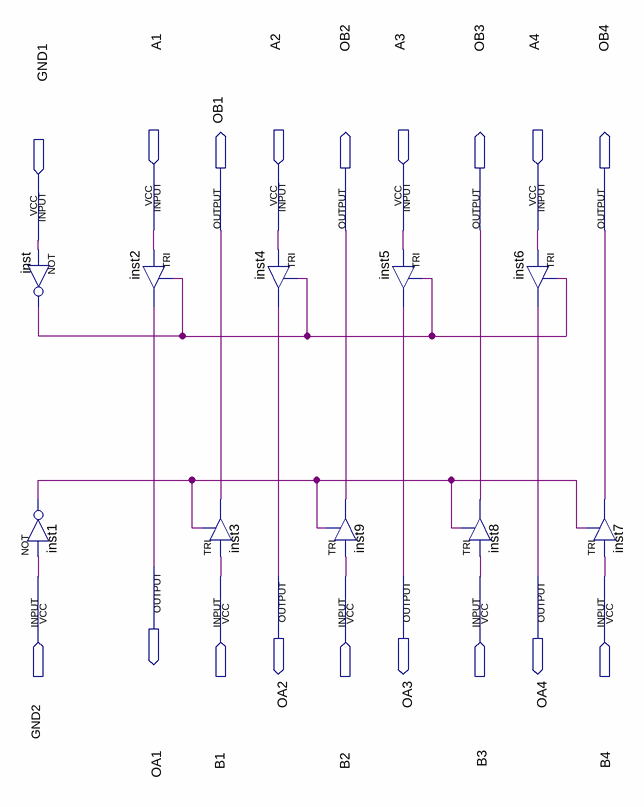
[diagram p0: schematic sheet]
// Quartus schematic ALP74LS244.bdf as structural Verilog: 10 symbols, 18 pins
module ALP74LS244 (
  input  A1,
  input  A2,
  input  A3,
  input  A4,
  input  GND1,
  input  GND2,
  input  B1,
  input  B2,
  input  B3,
  input  B4,
  output OB1,
  output OB2,
  output OB3,
  output OB4,
  output OA1,
  output OA2,
  output OA3,
  output OA4
);

  wire inst1_out, inst_out;

  not inst (inst_out, GND1);
  not inst1 (inst1_out, GND2);
  TRI inst2 (.IN(A1), .OE(inst_out), .OUT(OA1));
  TRI inst4 (.IN(A2), .OE(inst_out), .OUT(OA2));
  TRI inst3 (.IN(B1), .OE(inst1_out), .OUT(OB1));
  TRI inst9 (.IN(B2), .OE(inst1_out), .OUT(OB2));
  TRI inst5 (.IN(A3), .OE(inst_out), .OUT(OA3));
  TRI inst8 (.IN(B3), .OE(inst1_out), .OUT(OB3));
  TRI inst6 (.IN(A4), .OE(inst_out), .OUT(OA4));
  TRI inst7 (.IN(B4), .OE(inst1_out), .OUT(OB4));
endmodule
